# EAGLE design 1 (EAGLE 6.5.0)
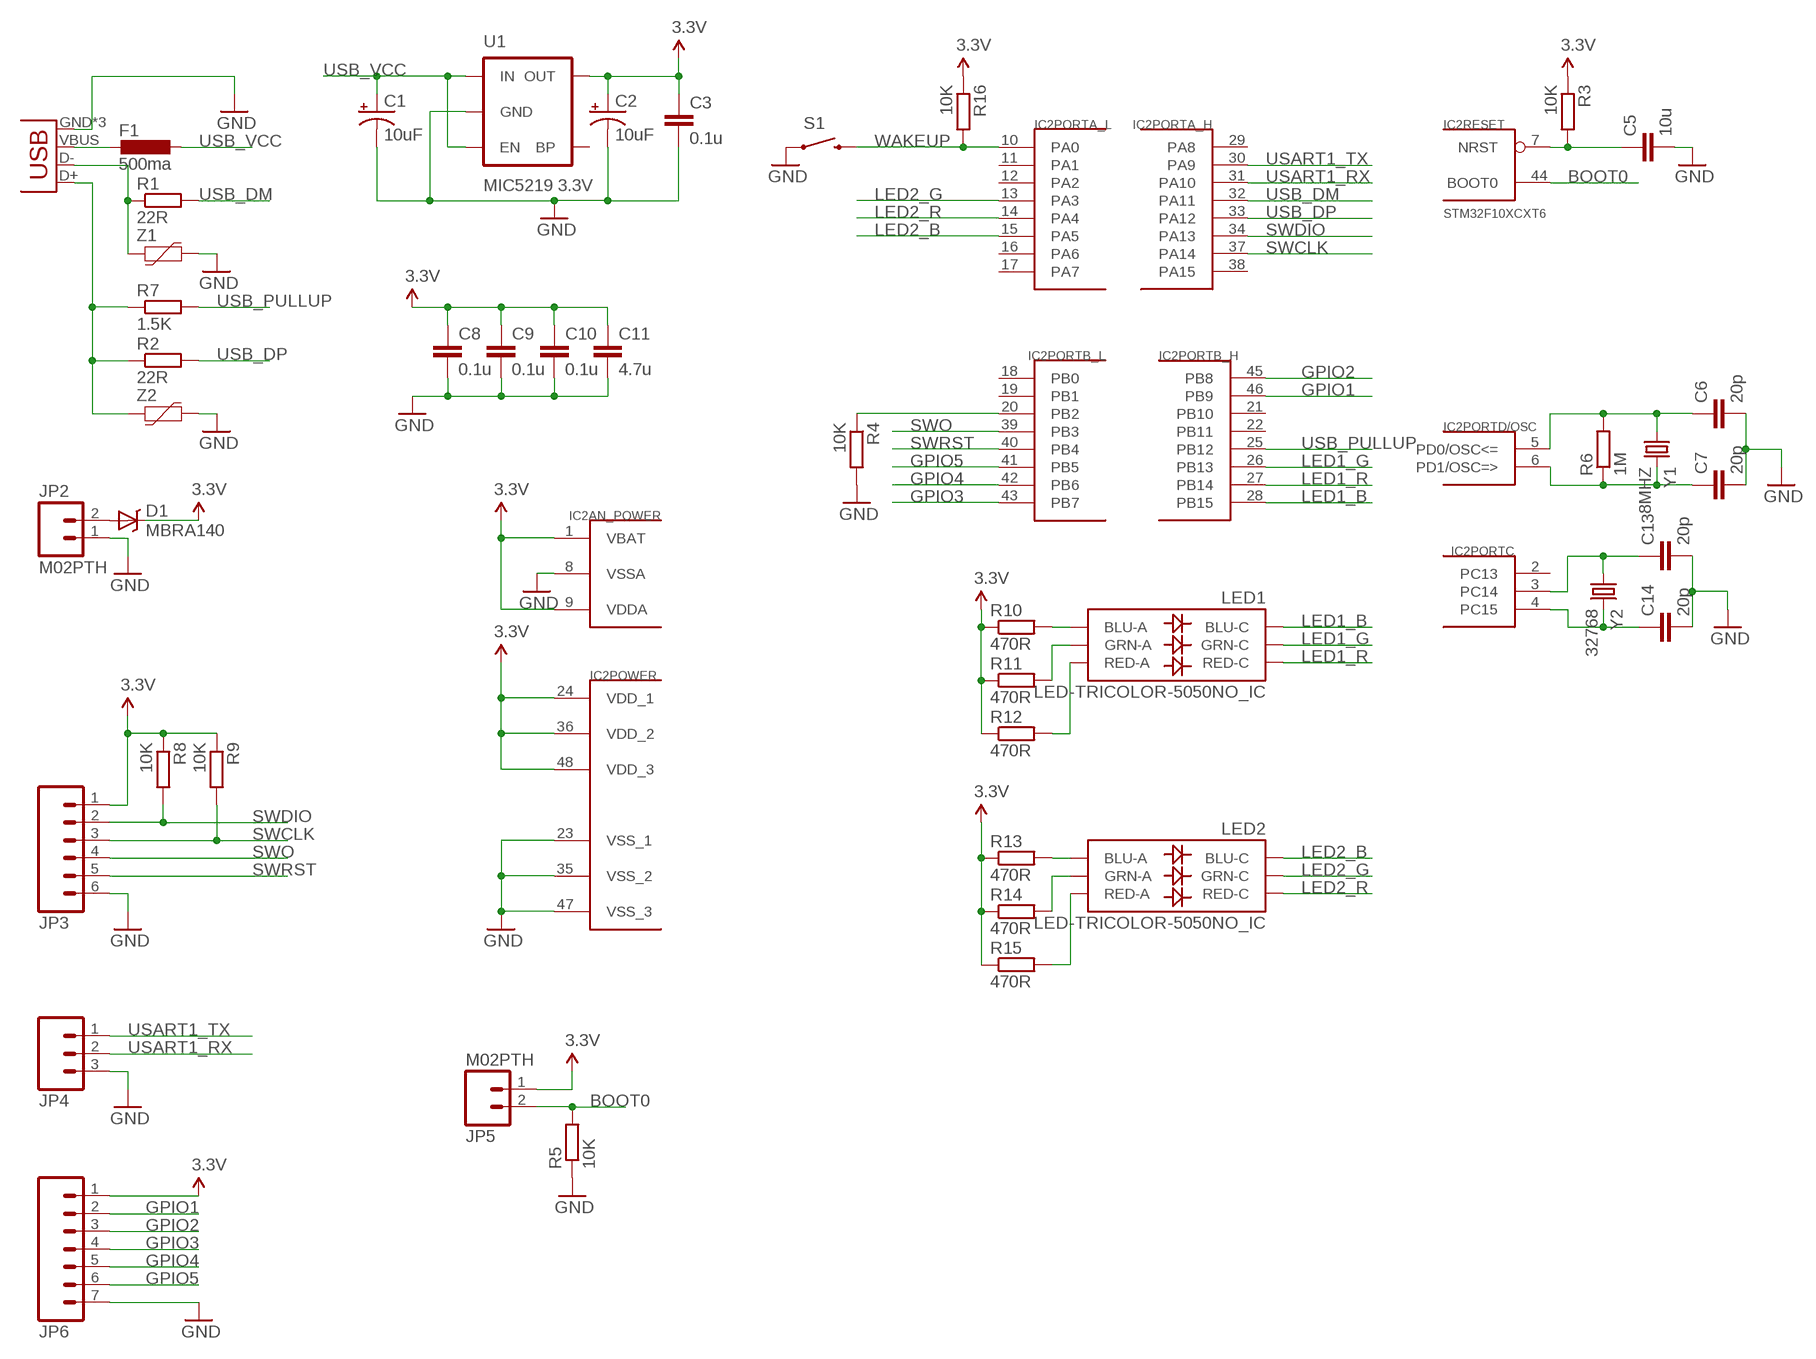
[diagram p0: schematic, sheet 1]

## Parts
C1  10uF  10UF-TANT  [EIA3216]
C2  10uF  10UF-TANT  [EIA3216]
C3  0.1u  C-EUC0603K  [C0603K]
C5  10u  C-EUC0603K  [C0603K]
C6  20p  C-EUC0603K  [C0603K]
C7  20p  C-EUC0603K  [C0603K]
C8  0.1u  C-EUC0603K  [C0603K]
C9  0.1u  C-EUC0603K  [C0603K]
C10  0.1u  C-EUC0603K  [C0603K]
C11  4.7u  C-EUC0603K  [C0603K]
C13  20p  C-EUC0603K  [C0603K]
C14  20p  C-EUC0603K  [C0603K]
D1  MBRA140  [SMA-DIODE]
F1  500ma  L-EUL2012C  [L2012C]
IC2  STM32F10XCXT6  [TQFP48]
JP1  USB-MICROB  [USB-MICROB]
JP2  M02PTH  [1X02]
JP3  M06SIP  [1X06]
JP4  M03PTH  [1X03]
JP5  M02PTH  [1X02]
JP6  M07  [1X07]
LED1  LED-TRICOLOR-5050NO_IC  [LED-TRICOLOR-5050]
LED2  LED-TRICOLOR-5050NO_IC  [LED-TRICOLOR-5050]
R1  22R  R-EU_R0603  [R0603]
R2  22R  R-EU_R0603  [R0603]
R3  10K  R-EU_R0603  [R0603]
R4  10K  R-EU_R0603  [R0603]
R5  10K  R-EU_R0603  [R0603]
R6  1M  R-EU_R0603  [R0603]
R7  1.5K  R-EU_R0603  [R0603]
R8  10K  R-EU_R0603  [R0603]
R9  10K  R-EU_R0603  [R0603]
R10  470R  R-EU_R0603  [R0603]
R11  470R  R-EU_R0603  [R0603]
R12  470R  R-EU_R0603  [R0603]
R13  470R  R-EU_R0603  [R0603]
R14  470R  R-EU_R0603  [R0603]
R15  470R  R-EU_R0603  [R0603]
R16  10K  R-EU_R0603  [R0603]
S1  SWITCH-MOMENTARY-2SMD-4  [TACTILE_SWITCH_TALL]
U1  MIC5219 3.3V  V_REG_MIC52193.3V  [SOT23-5]
Y1  8MHZ  CRYSTAL5X3  [CRYSTAL-SMD-5X3]
Y2  32768  CRYSTALEPSONMC146  [CRYSTAL-32KHZ-SMD_EPSON_MC146]
Z1  VARISTOR-0603  [0603-RES]
Z2  VARISTOR-0603  [0603-RES]

## Nets
3.3V: C2.A(+) C3.1 C8.1 C9.1 C10.1 C11.1 D1.C IC2.1(AN_POWER:VBAT) IC2.9(AN_POWER:VDDA) IC2.24(POWER:VDD_1) IC2.36(POWER:VDD_2) IC2.48(POWER:VDD_3) JP3.1 JP5.1 JP6.1 R3.1 R8.1 R9.1 R10.1 R11.1 R12.1 R13.1 R14.1 R15.1 R16.1 U1.5(OUT)
BOOT0: IC2.44(RESET:BOOT0) JP5.2 R5.2
GND: C1.C(-) C2.C(-) C3.2 C5.2 C6.2 C7.2 C8.2 C9.2 C10.2 C11.2 C13.2 C14.2 IC2.8(AN_POWER:VSSA) IC2.23(POWER:VSS_1) IC2.35(POWER:VSS_2) IC2.47(POWER:VSS_3) JP1.GND JP1.MT1(GND) JP1.MT2(GND) JP2.1 JP3.6 JP4.3 JP6.7 R4.2 R5.1 S1.A2 U1.2(GND) Z1.2 Z2.2
GPIO1: IC2.46(PORTB_H:PB9) JP6.2
GPIO2: IC2.45(PORTB_H:PB8) JP6.3
GPIO3: IC2.43(PORTB_L:PB7) JP6.4
GPIO4: IC2.42(PORTB_L:PB6) JP6.5
GPIO5: IC2.41(PORTB_L:PB5) JP6.6
LED1_B: IC2.28(PORTB_H:PB15) LED1.4(BLU-C)
LED1_G: IC2.26(PORTB_H:PB13) LED1.6(GRN-C)
LED1_R: IC2.27(PORTB_H:PB14) LED1.5(RED-C)
LED2_B: IC2.15(PORTA_L:PA5) LED2.4(BLU-C)
LED2_G: IC2.13(PORTA_L:PA3) LED2.6(GRN-C)
LED2_R: IC2.14(PORTA_L:PA4) LED2.5(RED-C)
N$1: D1.A JP2.2
N$2: IC2.20(PORTB_L:PB2) R4.1
N$3: JP1.D- R1.1 Z1.1
N$4: JP1.D+ R2.1 R7.1 Z2.1
N$6: C6.1 IC2.5(PORTD/OSC:PD0/OSC<=) R6.2 Y1.1
N$7: C7.1 IC2.6(PORTD/OSC:PD1/OSC=>) R6.1 Y1.3
N$8: LED1.3(BLU-A) R10.2
N$9: F1.2 JP1.VBUS
N$10: LED1.1(GRN-A) R11.2
N$11: LED1.2(RED-A) R12.2
N$12: LED2.3(BLU-A) R13.2
N$13: LED2.1(GRN-A) R14.2
N$14: LED2.2(RED-A) R15.2
N$18: C13.1 IC2.3(PORTC:PC14) Y2.P$2
N$19: C14.1 IC2.4(PORTC:PC15) Y2.P$1
RESET: C5.1 IC2.7(RESET:NRST) R3.2
SWCLK: IC2.37(PORTA_H:PA14) JP3.3 R9.2
SWDIO: IC2.34(PORTA_H:PA13) JP3.2 R8.2
SWO: IC2.39(PORTB_L:PB3) JP3.4
SWRST: IC2.40(PORTB_L:PB4) JP3.5
USART1_RX: IC2.31(PORTA_H:PA10) JP4.2
USART1_TX: IC2.30(PORTA_H:PA9) JP4.1
USB_DM: IC2.32(PORTA_H:PA11) R1.2
USB_DP: IC2.33(PORTA_H:PA12) R2.2
USB_PULLUP: IC2.25(PORTB_H:PB12) R7.2
USB_VCC: C1.A(+) F1.1 U1.1(IN) U1.3(EN)
WAKEUP: IC2.10(PORTA_L:PA0) R16.2 S1.B2
Unconnected: IC2.2(PORTC:PC13) IC2.11(PORTA_L:PA1) IC2.12(PORTA_L:PA2) IC2.16(PORTA_L:PA6) IC2.17(PORTA_L:PA7) IC2.18(PORTB_L:PB0) IC2.19(PORTB_L:PB1) IC2.21(PORTB_H:PB10) IC2.22(PORTB_H:PB11) IC2.29(PORTA_H:PA8) IC2.38(PORTA_H:PA15) U1.4(BP)

## Library data of the parts
C1 C2 = SparkFun-Capacitors:10UF-TANT: 10uF Tantalum SMT CAP-00811- 16V 10% (EIA-3216); PROD_ID: CAP-00811
C3 C5-C11 C13 C14 = rcl:C-EU: CAPACITOR, European symbol
D1 = SparkFun-DiscreteSemi:MBRA140: 40V, 1A Schottky rectifier SMA/DO-214AC package DIO-08053; PROD_ID: DIO-08053
F1 = rcl:L-EU: INDUCTOR, European symbol
IC2 = stm32:STM32F10XCXT6: ST STM32F101/103 48pin LQFP
JP1 = SparkFun-Connectors:USB: USB Connectors USB-B-PTH is fully proven SKU : PRT-00139/CONN-08278 USB-miniB is fully proven SKU : PRT-00587 USB-A-PCB is untested. USB-A-H is throughly reviewed, but untested. Spark Fun Electronics SKU : PRT-00437 USB-B-SMT is throughly reviewed, but untested. Needs silkscreen touching up. USB-A-S has not been used/tested USB-MB-H has not been used/tested USB-MICROB has been used. CONN-09505; PROD_ID: CONN-09505
JP2 JP5 = SparkFun-Connectors:M02: Standard 2-pin 0.1" header. Use with - straight break away headers ( PRT-00116) - right angle break away headers (PRT-00553) - swiss pins (PRT-00743) - machine pins (PRT-00117) - female headers (PRT-00115) Molex polarized connector foot print use with: PRT-08233 with associated crimp pins and housings. 2.54_SCREWTERM for use with PRT-10571. 3.5mm Screw Terminal footprints for PRT-08084 5mm Screw Terminal footprints for use with PRT-08433
JP3 = SparkFun-Connectors:M06: Header 6 Standard 6-pin 0.1" header. Use with straight break away headers (SKU : PRT-00116), right angle break away headers (PRT-00553), swiss pins (PRT-00743), machine pins (PRT-00117), and female headers (PRT-00115). Molex polarized connector foot print use with SKU : PRT-08094 with associated crimp pins and housings. NOTES ON THE VARIANTS LOCK and LOCK_LONGPADS... This footprint was designed to help hold the alignment of a through-hole component (i.e. 6-pin header) while soldering it into place. You may notice that each hole has been shifted either up or down by 0.005 of an inch from it's more standard position (which is a perfectly straight line). This slight alteration caused the pins (the squares in the middle) to touch the edges of the holes. Because they are alternating, it causes a "brace" to hold the component in place. 0.005 has proven to be the perfect amount of "off-center" position when using our standard breakaway headers. Although looks a little odd when you look at the bare footprint, once you have a header in there, the alteration is very hard to notice. Also,if you push a header all the way into place, it is covered up entirely on the bottom side. This idea of altering the position of holes to aid alignment will be further integrated into the Sparkfun Library for other footprints. It can help hold any component with 3 or more connection pins.
JP4 = SparkFun-Connectors:M03: Header 3 Standard 3-pin 0.1" header. Use with straight break away headers (SKU : PRT-00116), right angle break away headers (PRT-00553), swiss pins (PRT-00743), machine pins (PRT-00117), and female headers (PRT-00115). Molex polarized connector foot print use with SKU : PRT-08232 with associated crimp pins and housings.
JP6 = SparkFun-Connectors:M07: Header 7 Standard 7-pin 0.1" header. Use with straight break away headers (SKU : PRT-00116), right angle break away headers (PRT-00553), swiss pins (PRT-00743), machine pins (PRT-00117), and female headers (PRT-00115). NOTES ON THE VARIANTS LOCK and LOCK_LONGPADS... This footprint was designed to help hold the alignment of a through-hole component (i.e. 7-pin header) while soldering it into place. You may notice that each hole has been shifted either up or down by 0.005 of an inch from it's more standard position (which is usually a perfectly straight line). This slight alteration caused the pins (the squares in the middle) to touch the edges of the holes. Because they are alternating, it causes a "brace" to hold the header in place. 0.005 has proven to be the perfect amount of "off-center" position when using our standard breakaway headers. Although looks a little odd when you look at the bare footprint, once you have a header in there, the alteration is very hard to notice. Also, if you push a header all the way into place, it is covered up entirely on the bottom side. This idea of altering the position of holes to aid alignment will be further integrated into the Sparkfun Library for other footprints. It can help hold any component with 3 or more connection pins.
LED1 LED2 = SparkFun-LED:LED-TRICOLOR-5050
R1-R16 = rcl:R-EU_: RESISTOR, European symbol
S1 = SparkFun-Electromechanical:SWITCH-MOMENTARY-2: Various NO switches- pushbuttons, reed, etc
U1 = SparkFun-PowerIC:V_REG_MIC5219: V_REG MIC5219 Standard 3.3V and 5V 500mA LDO voltage regulator in SOT-23 layout. Micrel part MIC5219. BP (by-pass) pin is used to lower output noise with 470pF cap, may be left open.; PROD_ID: VREG-09872
Y1 Y2 = SparkFun-FreqCtrl:CRYSTAL: Various standard crystals. Proven footprints. Spark Fun Electronics SKU : COM-00534
Z1 Z2 = SparkFun-DiscreteSemi:VARISTOR: Varistor Varistor (Variable resistor) is a nonlinear resistive element of the voltage dependence that resistance changes with applied voltage. Varistor is equivalent with Zener diode of two series connection.

## Board
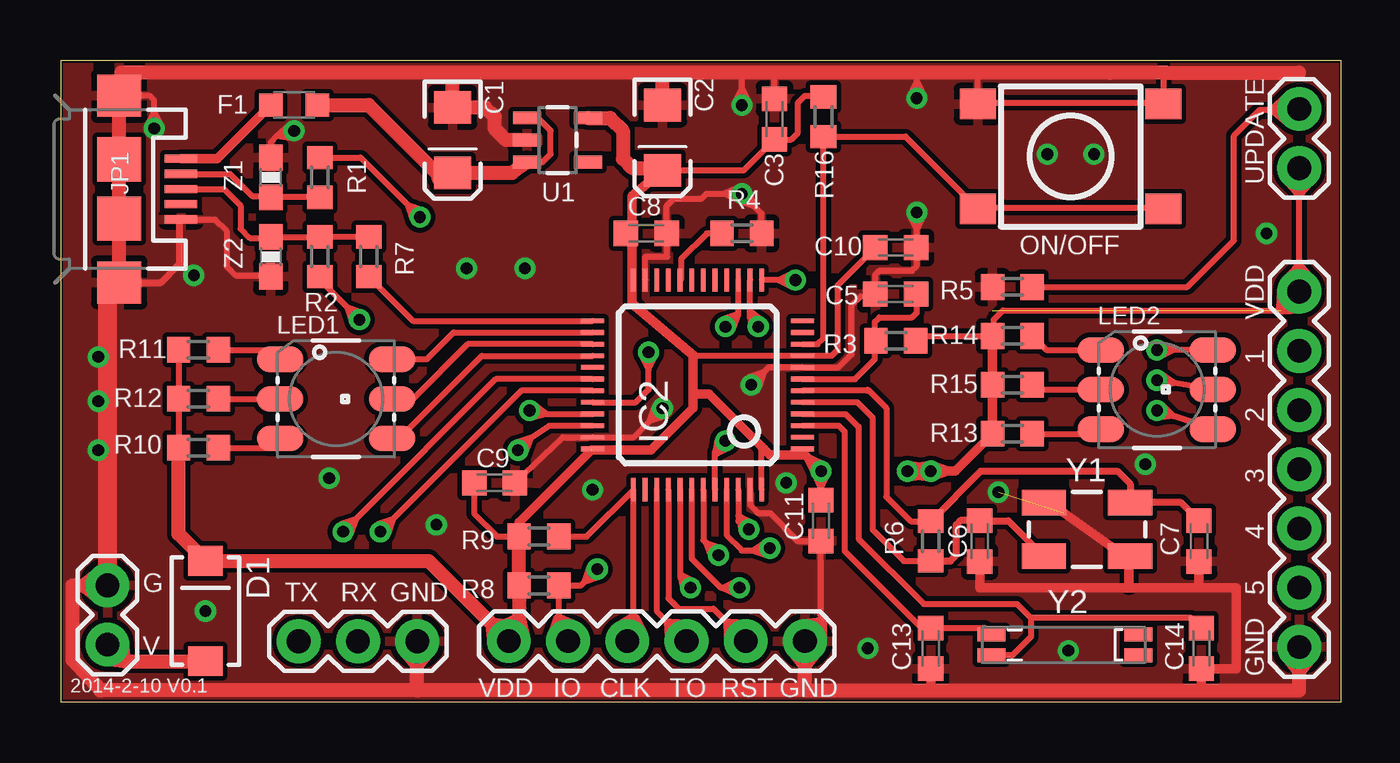
[diagram p1: board, top side]
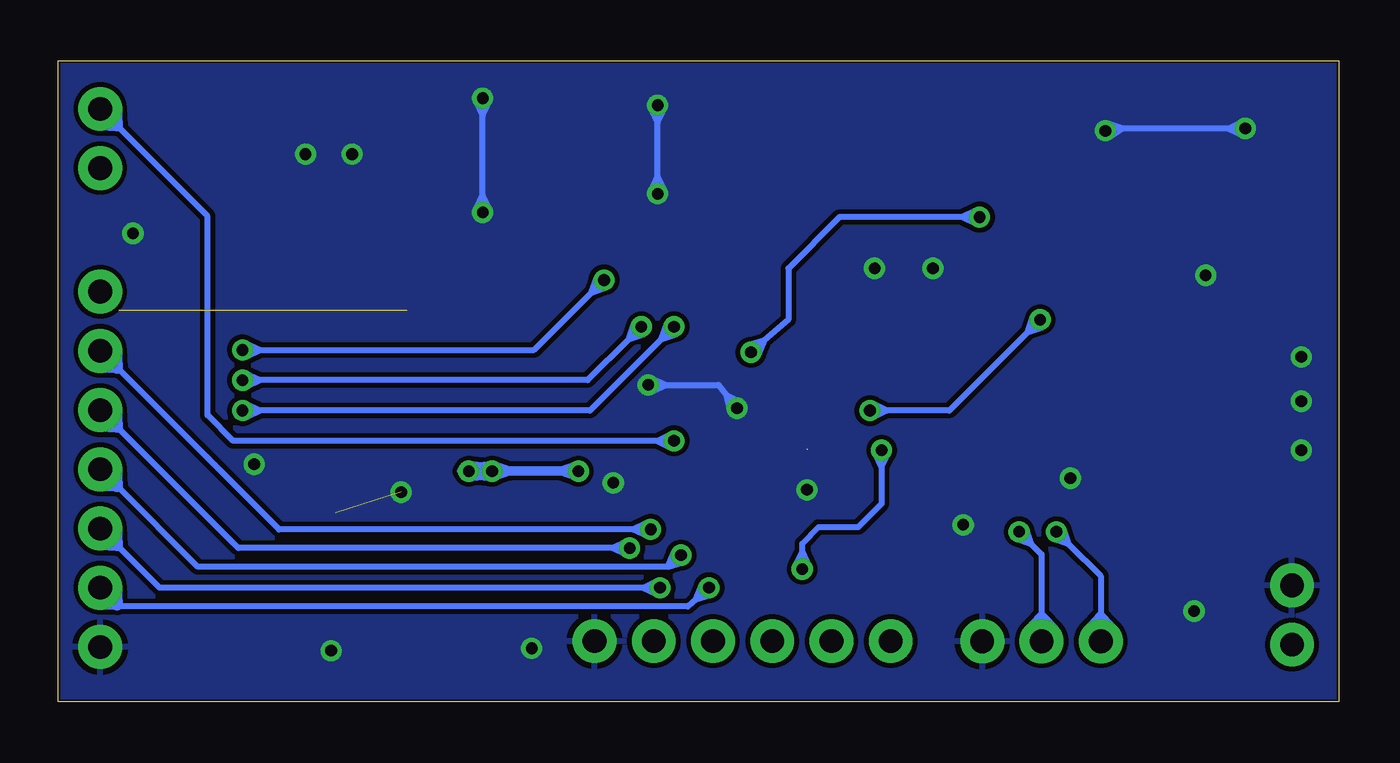
[diagram p2: board, bottom side, seen from below]

Size 54.9 x 27.5 mm. Coordinates in mm from the lower left corner, seen from the top.
Outline: 0,0 54.9,0 54.9,27.5 0,27.5 0,0
Copper layers (1*16): Top 0.035mm / dielectric 1.5mm / Bottom 0.035mm
Design rules "default *": minimum track width 10mil, minimum drill 24mil, track to track 8mil, track to pad 8mil, pad to pad 8mil, via to via 8mil, smd to smd 8mil, copper to edge 0.1mm, drill to drill 8mil, minimum pad ring 10mil, minimum via ring 8mil, stop-mask expansion 4mil, vias tented up to drill 0mil, thermal gap 10mil

### Footprints (pad centres in the part's own frame; a part is rotated, then mirrored left to right if it is on the bottom)
EIA3216 = smd 1.4 x 1.6: A 1.4,0; C -1.4,0
C0603K = smd 1.05 x 1.08: 1 -0.875,0; 2 0.875,0
SMA-DIODE = smd 1.27 x 1.47: A -2.15,0; C 2.15,0
L2012C = smd 1 x 1: 1 -1,0; 2 1,0
TQFP48 = smd 0.2 x 1: 1 -2.75,-4.5; 2 -2.25,-4.5; 3 -1.75,-4.5; 4 -1.25,-4.5; 5 -0.75,-4.5; 6 -0.25,-4.5; 7 0.25,-4.5; 8 0.75,-4.5; 9 1.25,-4.5; 10 1.75,-4.5; 11 2.25,-4.5; 12 2.75,-4.5; 25 2.75,4.5; 26 2.25,4.5; 27 1.75,4.5; 28 1.25,4.5; 29 0.75,4.5; 30 0.25,4.5; 31 -0.25,4.5; 32 -0.75,4.5; 33 -1.25,4.5; 34 -1.75,4.5; 35 -2.25,4.5; 36 -2.75,4.5 | smd 1 x 0.2: 13 4.5,-2.75; 14 4.5,-2.25; 15 4.5,-1.75; 16 4.5,-1.25; 17 4.5,-0.75; 18 4.5,-0.25; 19 4.5,0.25; 20 4.5,0.75; 21 4.5,1.25; 22 4.5,1.75; 23 4.5,2.25; 24 4.5,2.75; 37 -4.5,2.75; 38 -4.5,2.25; 39 -4.5,1.75; 40 -4.5,1.25; 41 -4.5,0.75; 42 -4.5,0.25; 43 -4.5,-0.25; 44 -4.5,-0.75; 45 -4.5,-1.25; 46 -4.5,-1.75; 47 -4.5,-2.25; 48 -4.5,-2.75
USB-MICROB = smd 0.35 x 1.4: D+ 0,2.65; D- -0.65,2.65; GND 1.3,2.65; ID 0.65,2.65; VBUS -1.3,2.65 | smd 1.8 x 1.9: MT1 -4,0; MT2 4,0 | smd 1.9 x 1.9: P$1 -1.27,0; P$2 1.27,0
1X02 = drill 1.016 pad 1.88: 1 0,0; 2 2.54,0
1X06 = drill 1.016 pad 1.88: 1 0,0; 2 2.54,0; 3 5.08,0; 4 7.62,0; 5 10.16,0; 6 12.7,0
1X03 = drill 1.016 pad 1.88: 1 0,0; 2 2.54,0; 3 5.08,0
1X07 = drill 1.016 pad 1.88: 1 0,0; 2 2.54,0; 3 5.08,0; 4 7.62,0; 5 10.16,0; 6 12.7,0; 7 15.24,0
LED-TRICOLOR-5050 = smd 2 x 1.1: 1 -2.4,1.7; 2 -2.4,0; 3 -2.4,-1.7; 4 2.4,-1.7; 5 2.4,0; 6 2.4,1.7
R0603 = smd 1 x 1.1: 1 -0.85,0; 2 0.85,0
TACTILE_SWITCH_TALL = smd 1.55 x 1.3: A1 -3.975,-2.25; A2 3.975,-2.25; B1 -3.975,2.25; B2 3.975,2.25
SOT23-5 = smd 0.55 x 1.2: 1 -0.95,-1.3; 2 0,-1.3; 3 0.95,-1.3; 4 0.95,1.3; 5 -0.95,1.3
CRYSTAL-SMD-5X3 = smd 1.9 x 1.1: 1 -1.85,-1.15; 2 1.85,-1.15; 3 1.85,1.15; 4 -1.85,1.15
CRYSTAL-32KHZ-SMD_EPSON_MC146 = smd 1.2 x 0.6: NC1 6.9,1.2; NC2 6.9,0.3; P$1 0.6,0.3; P$2 0.6,1.2
0603-RES = smd 1.1 x 1: 1 -0.85,0; 2 0.85,0

### Placement (x,y rotation side)
C1  16.8,24.1 270 top
C2  25.8,24.2 270 top
C3  30.6,25 90 top
C5  35.8,17.5 180 top
C6  39.4,6.9 270 top
C7  48.8,6.9 270 top
C8  25.1,20.1 0 top
C9  18.6,9.4 0 top
C10  35.8,19.49 0 top
C11  32.59,7.78 270 top
C13  37.3,2.3 270 top
C14  48.9,2.3 270 top
D1  6.2,3.9 90 top
F1  10,25.6 180 top
IC2  27.3,13.6 90 top
JP1  2.5,22 270 top
JP2  2,5 270 top
JP3  19.21,2.61 0 top
JP4  10.2,2.6 0 top
JP5  53.1,22.9 90 top
JP6  53.1,17.6 270 top
LED1  11.8,13 0 top
LED2  47,13.4 0 top
R1  11.1,22.5 90 top
R2  11.1,19.1 270 top
R3  35.8,15.5 180 top
R4  29.2,20.1 0 top
R5  40.8,17.8 0 top
R6  37.3,6.9 270 top
R7  13.2,19.1 270 top
R8  20.5,5 0 top
R9  20.5,7.1 0 top
R10  5.9,10.9 0 top
R11  5.9,15.1 0 top
R12  5.9,13 0 top
R13  40.8,11.5 0 top
R14  40.8,15.7 0 top
R15  40.8,13.6 0 top
R16  32.7,25.1 270 top
S1  43.3,23.4 180 top
U1  21.3,24.1 270 top
Y1  44,7.4 0 top
Y2  39.3,1.7 0 top
Z1  9,22.5 90 top
Z2  9,19.1 270 top

### Tracks (layer width: path | path; a pad name or v marks a point on that pad's centre or on a via)
3.3V  (via drill 0.5, 0.5 pad 0.25)  (2 unrouted)
  Top 0.254: R10.1 R12.1 R11.1 | 19.65,2.45 JP3.1 | 27.1,14.8 27.15,14.85 IC2.9 33.05,14.85 33.3,15.1 33.3,17.86 C10.1 | C2.A 29.27,22.8 C3.1 31.32,24.12 31.6,24.4 31.6,25.7 31.9,26 32.65,26 R16.1 32.42,25.95 | IC2.24 24.55,17.85 24.5,17.6 | IC2.48 30.05,10.95 30.15,10.85 | 27.3,13.2 27.1,13.4 | C8.1 24.5,20.38 24.5,20.8 | C11.1 32.59,9.15 | 32.59,9.15 32.59,9.59 v32.6,9.9 | C9.1 17.73,8.07 18.7,7.1 R9.1 | R3.1 36.85,15.7 R14.1 40,15.7 40,16.4 40.4,16.8 52.3,16.8 52.38,16.88 JP6.1 53.1,18.62 53.1,21.88 JP5.1 | 31.9,10.6 31.9,10.75 IC2.1 | 32.59,9.15 32.89,9.75 v32.6,9.9 | 32.59,9.15 32.3,9.76 v32.6,9.9
  Top 0.406: C2.A 24.5,21.7 24.5,20.8 24.5,17.6 24.5,17.1 27.15,14.85 | 27.1,14.8 27.1,13.4 27.1,12.6 25.3,10.8 22.75,10.8 19.65,7.7 R9.1 | R14.1 R15.1 R13.1 38.35,9.9 38.05,9.9 | 30.05,10.95 27.8,13.2 27.3,13.2 | v36.3,9.9 36.55,9.9 | 36.55,9.9 37.05,9.9 | 37.05,9.9 v37.3,9.9 | v37.3,9.9 38.05,9.9 | v32.6,9.9 32.07,10.43 | 32.07,10.43 31.9,10.6 30.4,10.6 30.15,10.85 | 36.55,9.9 37.03,9.73 | 37.03,9.73 37.22,9.66 | 32.07,10.43 32.37,9.79 v32.6,9.9 | 32.07,10.43 32.71,10.13 v32.6,9.9 | 36.57,10.07 36.38,10.14 | v36.3,9.9 36.38,10.14 | 37.05,9.9 36.38,9.66 | v36.3,9.9 36.38,9.66 | 37.05,9.9 36.57,10.07 | 36.57,10.07 36.38,10.14 | 37.05,9.9 36.38,9.66 | 37.05,9.9 36.38,10.14 | v36.3,9.9 36.38,10.14 | 37.05,9.9 36.38,9.66 | v36.3,9.9 36.38,9.66 | 37.03,9.73 36.44,10.11 v36.3,9.9 | 37.03,9.73 36.33,9.65 v36.3,9.9 | v36.3,9.9 36.33,10.15 37.03,10.07 36.44,9.69 v36.3,9.9 | 36.55,9.9 37.22,9.66 | v37.3,9.9 37.22,9.66 | 36.55,9.9 37.22,10.14 | v37.3,9.9 37.22,10.14 | 38.05,9.9 37.38,10.14 | v37.3,9.9 37.38,10.14 | 38.05,9.9 37.38,9.66 | v37.3,9.9 37.38,9.66 | 36.57,10.07 37.16,9.69 v37.3,9.9 | 36.57,10.07 37.27,10.15 v37.3,9.9 | v37.3,9.9 37.27,9.65 36.57,9.73 37.16,10.11 v37.3,9.9 | 36.55,9.9 37.22,9.66 | 36.55,9.9 37.22,10.14 | 36.55,9.9 37.22,9.66 | v37.3,9.9 37.22,9.66 | 36.55,9.9 37.22,10.14 | v37.3,9.9 37.22,10.14 | 38.05,9.9 37.38,10.14 | 38.05,9.9 37.38,9.66 | 38.05,9.9 37.38,10.14 | v37.3,9.9 37.38,10.14 | 38.05,9.9 37.38,9.66 | v37.3,9.9 37.38,9.66
  Top 0.508: JP6.1 53.13,16.91 52.38,16.88 52.41,17.63 JP6.1 | JP6.1 52.59,18.06 53.1,18.62 53.61,18.06 JP6.1 | 53.1,21.88 53.61,22.44 JP5.1 52.59,22.44 53.1,21.88
  Top 0.61: 19.65,3.53 R8.1 R9.1 | 19.65,3.53 19.65,2.45 | R10.1 5.05,7.2 D1.C 15.77,6.05 18.49,3.33 | 18.49,3.33 JP3.1 | U1.5 23.55,25.05 24.1,24.5 24.1,23.3 24.5,22.9 25.7,22.9 C2.A | 19.65,3.53 18.93,3.18 JP3.1 | 19.65,3.53 19.83,2.75 JP3.1 | 18.49,3.33 18.58,2.54 JP3.1 | 18.49,3.33 19.28,3.24 JP3.1
  Bottom 0.406: v32.6,9.9 33.35,9.9 | 33.35,9.9 35.55,9.9 | 35.55,9.9 v36.3,9.9 | v36.3,9.9 36.55,9.9 | 36.55,9.9 37.05,9.9 | 37.05,9.9 v37.3,9.9 | v37.3,9.9 37.6,9.9 | 36.55,9.9 37.03,9.73 | 37.03,9.73 37.22,9.66 | 33.35,9.9 32.68,10.14 | v32.6,9.9 32.68,10.14 | 33.35,9.9 32.68,9.66 | v32.6,9.9 32.68,9.66 | 33.35,9.9 32.68,10.14 | 33.35,9.9 32.68,9.66 | 33.35,9.9 32.68,10.14 | v32.6,9.9 32.68,10.14 | 33.35,9.9 32.68,9.66 | v32.6,9.9 32.68,9.66 | 35.55,9.9 36.22,9.66 | v36.3,9.9 36.22,9.66 | 35.55,9.9 36.22,10.14 | v36.3,9.9 36.22,10.14 | 36.57,10.07 36.38,10.14 | v36.3,9.9 36.38,10.14 | 37.05,9.9 36.38,9.66 | v36.3,9.9 36.38,9.66 | 35.55,9.9 36.22,9.66 | 35.55,9.9 36.22,10.14 | 35.55,9.9 36.22,9.66 | v36.3,9.9 36.22,9.66 | 35.55,9.9 36.22,10.14 | v36.3,9.9 36.22,10.14 | 37.05,9.9 36.57,10.07 | 36.57,10.07 36.38,10.14 | 37.05,9.9 36.38,9.66 | 37.05,9.9 36.38,10.14 | v36.3,9.9 36.38,10.14 | 37.05,9.9 36.38,9.66 | v36.3,9.9 36.38,9.66 | 37.03,9.73 36.44,10.11 v36.3,9.9 | 37.03,9.73 36.33,9.65 v36.3,9.9 | v36.3,9.9 36.33,10.15 37.03,10.07 36.44,9.69 v36.3,9.9 | 36.55,9.9 37.22,9.66 | v37.3,9.9 37.22,9.66 | 36.55,9.9 37.22,10.14 | v37.3,9.9 37.22,10.14 | 36.57,10.07 37.16,9.69 v37.3,9.9 | 36.57,10.07 37.27,10.15 v37.3,9.9 | v37.3,9.9 37.27,9.65 36.57,9.73 37.16,10.11 v37.3,9.9 | 36.55,9.9 37.22,9.66 | 36.55,9.9 37.22,10.14 | 36.55,9.9 37.22,9.66 | v37.3,9.9 37.22,9.66 | 36.55,9.9 37.22,10.14 | v37.3,9.9 37.22,10.14
BOOT0  (via drill 0.5)
  Top 0.254: IC2.44 28.05,10.6 | 28.05,10.6 28.05,10.75 v28.5,11.2 | R5.2 48.3,17.8 50.3,19.8 50.3,24.3 51.4,25.4 52.09,25.4 53.06,25.4 JP5.2 | 28.05,10.6 28.65,10.91 v28.5,11.2 | 28.05,10.6 28.18,11.26 v28.5,11.2
  Top 0.508: 52.09,25.4 52.66,24.92 JP5.2 52.62,25.93 52.09,25.4
  Bottom 0.254: v28.5,11.2 29.25,11.2 | 29.25,11.2 47.4,11.2 48.5,12.3 48.5,20.84 52.38,24.72 JP5.2 | 29.25,11.2 28.64,11.49 | v28.5,11.2 28.64,11.49 | 29.25,11.2 28.64,10.91 | v28.5,11.2 28.64,10.91 | 29.25,11.2 28.64,11.49 | 28.64,11.49 | v28.5,11.2 28.64,11.49 | 29.25,11.2 28.64,10.91 | v28.5,11.2 28.64,10.91 | 29.25,11.2 28.64,11.49 | v28.5,11.2 28.64,11.49 | 29.25,11.2 28.64,10.91 | v28.5,11.2 28.64,10.91
  Bottom 0.508: 52.38,24.72 53.13,24.75 JP5.2 52.41,25.47 52.38,24.72
GND  (via drill 0.5, 0.5 pad 0.25)  (1 unrouted)
  Top 0.254: Z1.2 9,24 9.28,24.28 | 9.28,24.28 9.5,24.5 v10,24.5 | JP1.GND 6.6,20.7 7.1,20.2 7.1,18.7 7.5,18.3 8.95,18.3 Z2.2 | C3.2 30.6,27 | 48.9,1.3 C14.2 49.42,1.43 48.9,0.9 | v29.2,25.6 29.2,26.35 | 29.2,26.35 29.2,27 | 30.13,14.13 30.35,14.35 IC2.8 33.35,14.35 33.9,14.9 33.9,17 34.3,17.4 C5.2 34.92,18.32 35.1,18.5 36.5,18.5 36.7,18.7 36.7,19.46 C10.2 36.67,19.15 36.7,19.15 36.7,20.25 | 30.13,14.13 v29.6,13.6 | C6.2 39.4,5.6 | 48.8,5.6 C7.2 | 25.27,12.07 24.55,11.35 IC2.35 21.52,11.35 C9.2 | 25.27,12.07 v25.8,12.6 | R4.2 30.05,20.95 29.73,21.27 | 29.73,21.27 v29.2,21.8 | 28.45,21.8 27.68,21.8 27.48,21.6 26.3,21.6 25.98,21.27 C8.2 26,20.1 26,19.1 25.05,19.1 IC2.23 | 28.45,21.8 v29.2,21.8 | 47.5,26.9 47.4,27 | S1.A2 39.33,26.98 39.3,27 | 36.7,20.25 v36.7,21 | v36.7,25.9 36.7,26.65 | 36.7,26.65 36.7,27 | JP3.6 32.59,3.29 32.59,3.37 C11.2 31.59,6.91 30.4,8.1 29.9,8.1 29.55,8.45 IC2.47 | v4,24.6 4,25.35 | 4,25.35 4,25.8 3.8,26 JP1.MT1 | 9.28,24.28 9.95,24.18 v10,24.5 | 9.28,24.28 9.78,24.74 v10,24.5 | 4,25.35 | 4,25.35 3.71,24.74 | v4,24.6 3.71,24.74 | 4,25.35 | 4,25.35 4.29,24.74 | v4,24.6 4.29,24.74 | 4,25.35 3.71,24.74 | 3.71,24.74 | v4,24.6 3.71,24.74 | 4,25.35 4.29,24.74 | v4,24.6 4.29,24.74 | 4,25.35 3.71,24.74 | v4,24.6 3.71,24.74 | 4,25.35 4.29,24.74 | v4,24.6 4.29,24.74 | 28.45,21.8 | 28.45,21.8 29.06,21.51 | v29.2,21.8 29.06,21.51 | 28.45,21.8 | 28.45,21.8 29.06,22.09 | v29.2,21.8 29.06,22.09 | 29.73,21.27 29.51,21.91 v29.2,21.8 | 29.73,21.27 29.09,21.49 v29.2,21.8 | 28.45,21.8 29.06,21.51 | 29.06,21.51 | v29.2,21.8 29.06,21.51 | 28.45,21.8 29.06,22.09 | v29.2,21.8 29.06,22.09 | 28.45,21.8 29.06,21.51 | v29.2,21.8 29.06,21.51 | 28.45,21.8 29.06,22.09
  Top 0.254: v29.2,21.8 29.06,22.09 | 29.2,26.35 | 29.2,26.35 28.91,25.74 | v29.2,25.6 28.91,25.74 | 29.2,26.35 | 29.2,26.35 29.49,25.74 | v29.2,25.6 29.49,25.74 | 29.2,26.35 28.91,25.74 | 28.91,25.74 | v29.2,25.6 28.91,25.74 | 29.2,26.35 29.49,25.74 | v29.2,25.6 29.49,25.74 | 29.2,26.35 28.91,25.74 | v29.2,25.6 28.91,25.74 | 29.2,26.35 29.49,25.74 | v29.2,25.6 29.49,25.74 | 25.27,12.07 25.91,12.29 v25.8,12.6 | 25.27,12.07 25.49,12.71 v25.8,12.6 | 30.13,14.13 29.49,13.91 v29.6,13.6 | 30.13,14.13 29.91,13.49 v29.6,13.6 | 36.7,20.25 36.99,20.86 | v36.7,21 36.99,20.86 | 36.7,20.25 36.41,20.86 | v36.7,21 36.41,20.86 | 36.7,20.25 36.99,20.86 | 36.99,20.86 | v36.7,21 36.99,20.86 | 36.7,20.25 36.41,20.86 | v36.7,21 36.41,20.86 | 36.7,20.25 36.99,20.86 | v36.7,21 36.99,20.86 | 36.7,20.25 36.41,20.86 | v36.7,21 36.41,20.86 | 36.7,26.65 | 36.7,26.65 36.41,26.04 | v36.7,25.9 36.41,26.04 | 36.7,26.65 | 36.7,26.65 36.99,26.04 | v36.7,25.9 36.99,26.04 | 36.7,26.65 36.41,26.04 | 36.41,26.04 | v36.7,25.9 36.41,26.04 | 36.7,26.65 36.99,26.04 | v36.7,25.9 36.99,26.04 | 36.7,26.65 36.41,26.04 | v36.7,25.9 36.41,26.04 | 36.7,26.65 36.99,26.04 | v36.7,25.9 36.99,26.04
  Top 0.305: JP1.MT2 4.3,18 5.1,18.8 5.1,20.65 JP1.GND
  Top 0.406: 48.8,4.9 39.4,4.9 39.4,5.6 | C13.2 37.3,0.5 | 48.9,0.9 48.9,0.5 | 48.8,4.9 C7.2 | 48.8,4.9 50.4,4.9 50.4,1.43 49.42,1.43 | 43,8.1 45,6.7
  Top 0.508: 32.59,3.37 31.84,3.29 JP3.6 32.6,2.62 32.59,3.37
  Top 0.61: 44.98,26.98 45,27 | 45,27 39.3,27 36.7,27 30.6,27 29.2,27 25.8,27 | 25.8,27 16.9,27 | 16.9,27 16.8,26.9 C1.C 18.2,25.5 18.6,25.1 18.6,24.6 19.1,24.1 U1.2 | C2.C 25.8,27 | 15.28,0.5 1.7,0.5 0.5,1.8 0.5,5 0.98,5 | JP3.6 31.91,1.71 | 31.91,0.5 15.28,0.5 | 45,27 47.4,27 53.1,27 | 31.91,0.5 37.3,0.5 48.9,0.5 53.1,0.5 53.1,1.34 | 16.9,27 2.6,27 2.6,26 JP1.MT1 JP1.MT2 | 53.1,1.34 | 53.1,1.34 JP6.7 | 31.91,0.5 31.91,1.59 | 31.91,1.59 | 31.91,1.59 JP3.6 | 15.28,0.5 15.28,1.58 | 15.28,1.58 | 15.28,1.58 JP4.3 | 0.98,5 | 0.98,5 JP2.1 | 0.98,5 | 0.98,5 1.6,5.5 | 0.98,5 1.6,4.5 | 1.6,4.5 | JP2.1 1.6,4.5 | 0.98,5 1.6,5.5 | JP2.1 1.6,5.5 | 0.98,5 1.6,4.5 | JP2.1 1.6,4.5 | 0.98,5 1.6,5.5 | JP2.1 1.6,5.5 | 31.91,1.59 32.41,2.21 | 31.91,1.59 | 31.91,1.59 31.41,2.21 | 31.91,1.59 32.41,2.21 | 32.41,2.21 | JP3.6 32.41,2.21 | 31.91,1.59 31.41,2.21 | JP3.6 31.41,2.21 | 31.91,1.59 32.41,2.21 | JP3.6 32.41,2.21 | 31.91,1.59 31.41,2.21 | JP3.6 31.41,2.21 | 15.28,1.58 15.78,2.2 | 15.28,1.58 | 15.28,1.58 14.78,2.2 | 15.28,1.58 15.78,2.2 | 15.78,2.2 | JP4.3 15.78,2.2 | 15.28,1.58 14.78,2.2 | JP4.3 14.78,2.2 | 15.28,1.58 15.78,2.2 | JP4.3 15.78,2.2 | 15.28,1.58 14.78,2.2 | JP4.3 14.78,2.2 | 53.1,1.34 53.6,1.96 | 53.1,1.34 | 53.1,1.34 52.6,1.96 | 53.1,1.34 53.6,1.96 | 53.6,1.96 | JP6.7 53.6,1.96 | 53.1,1.34 52.6,1.96 | JP6.7 52.6,1.96 | 53.1,1.34 53.6,1.96 | JP6.7 53.6,1.96 | 53.1,1.34 52.6,1.96 | JP6.7 52.6,1.96
  Top 0.813: JP2.1 2,17.5 JP1.MT2
  Bottom 0.254: v10,24.5 9.7,24.6 9.26,24.6 | v4,24.6 4.75,24.6 | 4.75,24.6 9.26,24.6 | v29.2,21.8 29.2,22.55 | 29.2,22.55 29.2,24.85 | 29.2,24.85 v29.2,25.6 | v29.6,13.6 28.85,13.6 | 28.85,13.6 26.6,13.6 26.27,13.19 | 26.27,13.19 v25.8,12.6 | v36.7,21 36.7,21.75 | 36.7,21.75 36.7,25.15 | 36.7,25.15 v36.7,25.9 | 9.26,24.6 9.82,24.23 v10,24.5 | 9.26,24.6 9.9,24.81 v10,24.5 | 4.75,24.6 4.14,24.89 | v4,24.6 4.14,24.89 | 4.75,24.6 4.14,24.31 | v4,24.6 4.14,24.31 | 4.75,24.6 4.14,24.89 | 4.14,24.89 | v4,24.6 4.14,24.89 | 4.75,24.6 4.14,24.31 | v4,24.6 4.14,24.31 | 4.75,24.6 4.14,24.89 | v4,24.6 4.14,24.89 | 4.75,24.6 4.14,24.31 | v4,24.6 4.14,24.31 | 29.2,22.55 | 29.2,22.55 28.91,21.94 | v29.2,21.8 28.91,21.94 | 29.2,22.55 | 29.2,22.55 29.49,21.94 | v29.2,21.8 29.49,21.94 | 29.2,22.55 28.91,21.94 | 28.91,21.94 | v29.2,21.8 28.91,21.94 | 29.2,22.55 29.49,21.94 | v29.2,21.8 29.49,21.94 | 29.2,22.55 28.91,21.94 | v29.2,21.8 28.91,21.94 | 29.2,22.55 29.49,21.94 | v29.2,21.8 29.49,21.94 | 29.2,24.85 29.49,25.46 | v29.2,25.6 29.49,25.46 | 29.2,24.85 28.91,25.46 | v29.2,25.6 28.91,25.46 | 29.2,24.85 29.49,25.46 | 29.49,25.46 | v29.2,25.6 29.49,25.46 | 29.2,24.85 28.91,25.46 | v29.2,25.6 28.91,25.46 | 29.2,24.85 29.49,25.46 | v29.2,25.6 29.49,25.46 | 29.2,24.85 28.91,25.46 | v29.2,25.6 28.91,25.46 | 26.27,13.19 25.66,12.89 v25.8,12.6 | 26.27,13.19 26.12,12.53 v25.8,12.6 | 28.85,13.6 | 28.85,13.6 29.46,13.31 | v29.6,13.6 29.46,13.31 | 28.85,13.6 | 28.85,13.6 29.46,13.89 | v29.6,13.6 29.46,13.89 | 28.85,13.6 29.46,13.31 | 29.46,13.31 | v29.6,13.6 29.46,13.31 | 28.85,13.6 29.46,13.89 | v29.6,13.6 29.46,13.89 | 28.85,13.6 29.46,13.31 | v29.6,13.6 29.46,13.31 | 28.85,13.6 29.46,13.89 | v29.6,13.6 29.46,13.89 | 36.7,21.75 | 36.7,21.75 36.41,21.14
  Bottom 0.254: v36.7,21 36.41,21.14 | 36.7,21.75 | 36.7,21.75 36.99,21.14 | v36.7,21 36.99,21.14 | 36.7,21.75 36.41,21.14 | 36.41,21.14 | v36.7,21 36.41,21.14 | 36.7,21.75 36.99,21.14 | v36.7,21 36.99,21.14 | 36.7,21.75 36.41,21.14 | v36.7,21 36.41,21.14 | 36.7,21.75 36.99,21.14 | v36.7,21 36.99,21.14 | 36.7,25.15 36.99,25.76 | v36.7,25.9 36.99,25.76 | 36.7,25.15 36.41,25.76 | v36.7,25.9 36.41,25.76 | 36.7,25.15 36.99,25.76 | 36.99,25.76 | v36.7,25.9 36.99,25.76 | 36.7,25.15 36.41,25.76 | v36.7,25.9 36.41,25.76 | 36.7,25.15 36.99,25.76 | v36.7,25.9 36.99,25.76 | 36.7,25.15 36.41,25.76 | v36.7,25.9 36.41,25.76
  other vias: 1.6,14.8 1.6,12.9 1.6,10.8 5.7,18.3 17.4,18.6 19.9,18.6 11.5,9.6 22.8,9.1 16.1,7.6 6.2,3.9 34.6,2.3 43.2,2.2 40.2,9 42.3,23.5 44.3,23.5 46.5,10.2 31.1,9.4 51.7,20.1
  pour Top: 0,27.5 0,0 54.9,0 54.9,27.5
  pour Bottom: 54.9,27.5 54.9,-0.1 0,-0.1 0,27.5
GPIO1  (via drill 0.5)
  Top 0.254: IC2.46 29.05,8 | 29.05,8 29.05,7.75 v29.5,7.4 | 29.05,8 29.18,7.34 v29.5,7.4 | 29.05,8 29.65,7.69 v29.5,7.4
  Bottom 0.254: v29.5,7.4 30.25,7.4 | 30.25,7.4 45.44,7.4 52.38,14.34 JP6.2 | 30.25,7.4 29.64,7.69 | v29.5,7.4 29.64,7.69 | 30.25,7.4 29.64,7.11 | v29.5,7.4 29.64,7.11 | 30.25,7.4 29.64,7.69 | 29.64,7.69 | v29.5,7.4 29.64,7.69 | 30.25,7.4 29.64,7.11 | v29.5,7.4 29.64,7.11 | 30.25,7.4 29.64,7.69 | v29.5,7.4 29.64,7.69 | 30.25,7.4 29.64,7.11 | v29.5,7.4 29.64,7.11
  Bottom 0.508: 52.38,14.34 53.13,14.38 JP6.2 52.41,15.09 52.38,14.34
GPIO2  (via drill 0.5)
  Top 0.254: IC2.45 28.55,7.15 29.2,6.5 29.66,6.5 | 29.66,6.5 30.1,6.5 v30.4,6.6 | 29.66,6.5 30.3,6.29 v30.4,6.6 | 29.66,6.5 30.22,6.87 v30.4,6.6
  Bottom 0.254: v30.4,6.6 31.15,6.6 | 31.15,6.6 47.18,6.6 52.38,11.8 JP6.3 | 31.15,6.6 30.54,6.89 | v30.4,6.6 30.54,6.89 | 31.15,6.6 30.54,6.31 | v30.4,6.6 30.54,6.31 | 31.15,6.6 30.54,6.89 | 30.54,6.89 | v30.4,6.6 30.54,6.89 | 31.15,6.6 30.54,6.31 | v30.4,6.6 30.54,6.31 | 31.15,6.6 30.54,6.89 | v30.4,6.6 30.54,6.89 | 31.15,6.6 30.54,6.31 | v30.4,6.6 30.54,6.31
  Bottom 0.508: 52.38,11.8 53.13,11.84 JP6.3 52.41,12.55 52.38,11.8
GPIO3  (via drill 0.5)
  Top 0.254: IC2.43 27.55,6.95 27.67,6.83 | 27.67,6.83 v28.2,6.3 | 27.67,6.83 27.89,6.19 v28.2,6.3 | 27.67,6.83 28.31,6.61 v28.2,6.3
  Bottom 0.254: v28.2,6.3 28.7,5.8 28.76,5.8 | 28.76,5.8 48.92,5.8 52.38,9.26 JP6.4 | 28.76,5.8 28.5,6.42 v28.2,6.3 | 28.76,5.8 28.11,5.99 v28.2,6.3
  Bottom 0.508: 52.38,9.26 53.13,9.29 JP6.4 52.41,10.01 52.38,9.26
GPIO4  (via drill 0.5)
  Top 0.254: IC2.42 27.05,6.15 28.3,4.9 28.35,4.9 | 28.35,4.9 v29.1,4.9 | 28.35,4.9 | 28.35,4.9 28.96,4.61 | v29.1,4.9 28.96,4.61 | 28.35,4.9 | 28.35,4.9 28.96,5.19 | v29.1,4.9 28.96,5.19 | 28.35,4.9 28.96,4.61 | 28.96,4.61 | v29.1,4.9 28.96,4.61 | 28.35,4.9 28.96,5.19 | v29.1,4.9 28.96,5.19 | 28.35,4.9 28.96,4.61 | v29.1,4.9 28.96,4.61 | 28.35,4.9 28.96,5.19 | v29.1,4.9 28.96,5.19
  Bottom 0.254: v29.1,4.9 29.85,4.9 | 29.85,4.9 50.56,4.9 52.38,6.72 JP6.5 | 29.85,4.9 29.24,5.19 | v29.1,4.9 29.24,5.19 | 29.85,4.9 29.24,4.61 | v29.1,4.9 29.24,4.61 | 29.85,4.9 29.24,5.19 | 29.24,5.19 | v29.1,4.9 29.24,5.19 | 29.85,4.9 29.24,4.61 | v29.1,4.9 29.24,4.61 | 29.85,4.9 29.24,5.19 | v29.1,4.9 29.24,5.19 | 29.85,4.9 29.24,4.61 | v29.1,4.9 29.24,4.61
  Bottom 0.508: 52.38,6.72 53.13,6.75 JP6.5 52.41,7.47 52.38,6.72
GPIO5  (via drill 0.5)
  Top 0.254: IC2.41 26.55,5.5 | 26.55,5.5 26.55,5.35 v27,4.9 | 26.55,5.5 26.68,4.84 v27,4.9 | 26.55,5.5 27.15,5.19 v27,4.9
  Bottom 0.254: v27,4.9 27.56,4.4 | 27.56,4.4 | 27.56,4.4 27.9,4.1 52.3,4.1 52.38,4.18 JP6.6 | 27.56,4.4 27.3,5.03 | 27.3,5.03 | 27.56,4.4 | 27.56,4.4 26.91,4.59 | v27,4.9 26.91,4.59 | 27.56,4.4 27.3,5.03 | 27.56,4.4 26.91,4.59 | 27.56,4.4 27.3,5.03 | v27,4.9 27.3,5.03 | 27.56,4.4 26.91,4.59 | v27,4.9 26.91,4.59
  Bottom 0.508: 52.38,4.18 53.13,4.21 JP6.6 52.41,4.93 52.38,4.18
LED1_B
  Top 0.254: IC2.28 18.05,14.85 14.8,11.6 14.5,11.6 LED1.4
LED1_G
  Top 0.254: LED1.6 15.7,14.7 16.85,15.85 IC2.26
LED1_R
  Top 0.254: 15,13.2 14.4,13.2 LED1.5 15.1,13 17.45,15.35 IC2.27
LED2_B  (via drill 0.5)
  Top 0.254: LED2.4 47.71,12.26 | 47.71,12.26 v47,12.5 | v28.5,16.1 29.03,16.63 | 29.03,16.63 29.05,16.65 IC2.15 | 47.71,12.26 47.23,12.73 v47,12.5 | 47.71,12.26 47.04,12.18 v47,12.5 | 29.03,16.63 28.39,16.41 v28.5,16.1 | 29.03,16.63 28.81,15.99 v28.5,16.1
  Bottom 0.254: v28.5,16.1 29.03,15.57 | 29.03,15.57 32.1,12.5 46.25,12.5 | 46.25,12.5 v47,12.5 | 46.25,12.5 | 46.25,12.5 46.86,12.21 | v47,12.5 46.86,12.21 | 46.25,12.5 | 46.25,12.5 46.86,12.79 | v47,12.5 46.86,12.79 | 46.25,12.5 46.86,12.21 | 46.86,12.21 | v47,12.5 46.86,12.21 | 46.25,12.5 46.86,12.79 | v47,12.5 46.86,12.79 | 46.25,12.5 46.86,12.21 | v47,12.5 46.86,12.21 | 46.25,12.5 46.86,12.79 | v47,12.5 46.86,12.79 | 29.03,15.57 28.81,16.21 v28.5,16.1 | 29.03,15.57 28.39,15.79 v28.5,16.1
LED2_G  (via drill 0.5)
  Top 0.254: LED2.6 47.75,15.1 | 47.75,15.1 v47,15.1 | v31.5,18.1 30.75,18.1 | 30.75,18.1 IC2.13 | 47.75,15.1 47.14,15.39 | v47,15.1 47.14,15.39 | 47.75,15.1 47.14,14.81 | v47,15.1 47.14,14.81 | 47.75,15.1 47.14,15.39 | 47.14,15.39 | v47,15.1 47.14,15.39 | 47.75,15.1 47.14,14.81 | v47,15.1 47.14,14.81 | 47.75,15.1 47.14,15.39 | v47,15.1 47.14,15.39 | 47.75,15.1 47.14,14.81 | v47,15.1 47.14,14.81 | 30.75,18.1 | 30.75,18.1 31.36,17.81 | v31.5,18.1 31.36,17.81 | 30.75,18.1 | 30.75,18.1 31.36,18.39 | v31.5,18.1 31.36,18.39 | 30.75,18.1 31.36,17.81 | 31.36,17.81 | v31.5,18.1 31.36,17.81 | 30.75,18.1 31.36,18.39 | v31.5,18.1 31.36,18.39 | 30.75,18.1 31.36,17.81 | v31.5,18.1 31.36,17.81 | 30.75,18.1 31.36,18.39 | v31.5,18.1 31.36,18.39
  Bottom 0.254: v47,15.1 46.25,15.1 | 46.25,15.1 34.5,15.1 32.03,17.57 | 32.03,17.57 v31.5,18.1 | 46.25,15.1 | 46.25,15.1 46.86,14.81 | v47,15.1 46.86,14.81 | 46.25,15.1 | 46.25,15.1 46.86,15.39 | v47,15.1 46.86,15.39 | 46.25,15.1 46.86,14.81 | 46.86,14.81 | v47,15.1 46.86,14.81 | 46.25,15.1 46.86,15.39 | v47,15.1 46.86,15.39 | 46.25,15.1 46.86,14.81 | v47,15.1 46.86,14.81 | 46.25,15.1 46.86,15.39 | v47,15.1 46.86,15.39 | 32.03,17.57 31.81,18.21 v31.5,18.1 | 32.03,17.57 31.39,17.79 v31.5,18.1
LED2_R  (via drill 0.5)
  Top 0.254: LED2.5 47.74,13.68 | 47.74,13.68 v47,13.8 | v29.9,16.1 29.55,16.45 29.55,16.76 | 29.55,16.76 IC2.14 | 47.74,13.68 47.19,14.07 v47,13.8 | 47.74,13.68 47.09,13.49 v47,13.8 | 29.55,16.76 29.57,16.09 v29.9,16.1 | 29.55,16.76 30.09,16.36 v29.9,16.1
  Bottom 0.254: v29.9,16.1 30.43,15.57 | 30.43,15.57 32.2,13.8 46.25,13.8 | 46.25,13.8 v47,13.8 | 46.25,13.8 | 46.25,13.8 46.86,13.51 | v47,13.8 46.86,13.51 | 46.25,13.8 | 46.25,13.8 46.86,14.09 | v47,13.8 46.86,14.09 | 46.25,13.8 46.86,13.51 | 46.86,13.51 | v47,13.8 46.86,13.51 | 46.25,13.8 46.86,14.09 | v47,13.8 46.86,14.09 | 46.25,13.8 46.86,13.51 | v47,13.8 46.86,13.51 | 46.25,13.8 46.86,14.09 | v47,13.8 46.86,14.09 | 30.43,15.57 30.21,16.21 v29.9,16.1 | 30.43,15.57 29.79,15.79 v29.9,16.1
N$1
  Top 0.61: JP2.2 2.71,1.75 2.73,1.75 | 2.73,1.75 D1.A | 2.73,1.75 2.63,2.54 JP2.2 | 2.73,1.75 1.94,1.83 JP2.2
N$2
  Top 0.254: R4.1 27.7,20.1 26.6,19 26.6,18.15 IC2.20
N$3
  Top 0.254: R1.1 Z1.1 8.95,21.7 8.2,21.7 7.25,22.65 JP1.D-
N$4
  Top 0.254: R7.1 R2.1 Z2.1 8.95,19.9 8.1,19.9 7.7,20.3 7.7,21.3 7,22 JP1.D+
N$6
  Top 0.254: IC2.5 34.15,12.85 34.8,12.2 34.8,7.4 36.15,6.05 R6.2 37.67,6.05
  Top 0.305: 37.67,6.05 38.15,6.05 38.4,6.3 38.4,7.6 38.6,7.8 39.38,7.8 C6.1 40.62,7.78 Y1.1
N$7
  Top 0.254: R6.1 36.45,7.75 35.4,8.8 35.4,12.6 34.6,13.4 34.55,13.35 IC2.6
  Top 0.305: R6.1 39.45,9.9 45.3,9.9 45.85,9.35 Y1.3 48.02,8.55 C7.1
N$8
  Top 0.254: R10.2 9,10.9 LED1.3
  Top 0.406: 8.7,11 LED1.3
N$9
  Top 0.406: JP1.VBUS 6.7,23.3 F1.2
N$10
  Top 0.254: R11.2 9.1,15.1 9.4,14.8 LED1.1
  Top 0.406: 8.7,15 LED1.1
N$11
  Top 0.254: R12.2 LED1.2
N$12
  Top 0.254: R13.2 44.4,11.5 LED2.3
N$13
  Top 0.254: 44.2,15.5 LED2.1 42.25,15.1 R14.2
N$14
  Top 0.254: 44.5,13.5 LED2.2 41.85,13.4 R15.2
N$18
  Top 0.254: Y2.P$2 39.62,3.17 C13.1 36.9,3.17 33.6,6.47 33.6,11.6 33.35,11.85 IC2.3
N$19
  Top 0.254: IC2.4 33.65,12.35 34.2,11.8 34.2,7 37,4.2 41,4.2 41.6,3.6 | 41.6,3.6 41.6,2.8 40.8,2 Y2.P$1 | C14.1 48.48,3.6 41.6,3.6
N$31
  Top 0.254: 39.4,25.7 47.2,25.7
N$32
  Top 0.254: 47.3,25.8 47.3,26.9
N$33
  Top 0.254: 39.3,21.2 47.3,21.2
N$35
  Top 0.406: 45.8,6.2 45.8,5
RESET
  Top 0.254: IC2.7 34.05,13.85 34.9,14.7 34.9,15.45 R3.2 34.9,15.5 34.9,16.3 35.1,16.5 36.5,16.5 36.7,16.7 36.7,17.48 C5.1 36.67,17.27
SWCLK
  Top 0.254: JP3.3 24.55,2.87 24.55,3.59 IC2.37 22.55,7.1 R9.2
  Top 0.508: 24.55,3.59 | 24.55,3.59 | 24.55,3.59 24.9,2.93 | 24.9,2.93 | 24.55,3.59 23.92,3.19 | 23.92,3.19 | JP3.3 23.92,3.19 | 24.55,3.59 24.9,2.93 | JP3.3 24.9,2.93 | 24.55,3.59 23.92,3.19 | JP3.3 23.92,3.19 | 24.55,3.59 24.9,2.93 | JP3.3 24.9,2.93
SWDIO  (via drill 0.5)
  Top 0.254: 21.35,2.41 21.35,3.54 R8.2 22.3,5 22.47,5.17 | 22.47,5.17 v23,5.7 | v19.6,10.8 20.13,11.33 | 20.13,11.33 20.95,11.85 IC2.34 | 22.47,5.17 23.11,5.39 v23,5.7 | 22.47,5.17 22.69,5.81 v23,5.7 | 20.13,11.33 19.49,11.11 v19.6,10.8 | 20.13,11.33 19.91,10.69 v19.6,10.8
  Top 0.508: 21.35,3.54 21.1,2.84 JP3.2 22.03,3.23 21.35,3.54
  Bottom 0.254: v23,5.7 23,6.45 | 23,6.45 23,6.8 22.3,7.5 20.6,7.5 19.6,8.5 19.6,10.05 | v19.6,10.8 19.6,10.05 | 23,6.45 | 23,6.45 22.71,5.84 | v23,5.7 22.71,5.84 | 23,6.45 | 23,6.45 23.29,5.84 | v23,5.7 23.29,5.84 | 23,6.45 22.71,5.84 | 22.71,5.84 | v23,5.7 22.71,5.84 | 23,6.45 23.29,5.84 | v23,5.7 23.29,5.84 | 23,6.45 22.71,5.84 | v23,5.7 22.71,5.84 | 23,6.45 23.29,5.84 | v23,5.7 23.29,5.84 | 19.6,10.05 19.89,10.66 | v19.6,10.8 19.89,10.66 | 19.6,10.05 19.31,10.66 | v19.6,10.8 19.31,10.66 | 19.6,10.05 19.89,10.66 | 19.89,10.66 | v19.6,10.8 19.89,10.66 | 19.6,10.05 19.31,10.66 | v19.6,10.8 19.31,10.66 | 19.6,10.05 19.89,10.66 | v19.6,10.8 19.89,10.66 | 19.6,10.05 19.31,10.66 | v19.6,10.8 19.31,10.66
SWO
  Top 0.254: IC2.39 25.55,3.89 26.11,3.33 JP3.4
  Top 0.508: 26.11,3.33 26.14,2.58 JP3.4 26.86,3.29 26.11,3.33
SWRST
  Top 0.254: IC2.40 26.05,4.45 26.5,4 27.98,4 28.65,3.33 JP3.5
  Top 0.508: 28.65,3.33 28.68,2.58 JP3.5 29.4,3.29 28.65,3.33
USART1_RX  (via drill 0.5)
  Top 0.254: IC2.31 19.75,13.35 14.23,7.83 | 14.23,7.83 v13.7,7.3 | 14.23,7.83 13.59,7.61 v13.7,7.3 | 14.23,7.83 14.01,7.19 v13.7,7.3
  Bottom 0.254: v13.7,7.3 13.17,6.77 | 13.17,6.77 12.74,6.34 12.74,3.62 | 12.74,3.62 | 12.74,3.62 JP4.2 | 13.17,6.77 13.81,6.99 v13.7,7.3 | 13.17,6.77 13.39,7.41 v13.7,7.3
  Bottom 0.508: 12.74,3.62 | 12.74,3.62 12.23,3.06 | 12.74,3.62 13.25,3.06 | 12.74,3.62 12.23,3.06 | JP4.2 12.23,3.06 | 12.74,3.62 13.25,3.06 | JP4.2 13.25,3.06 | 12.74,3.62 12.23,3.06 | JP4.2 12.23,3.06 | 12.74,3.62 13.25,3.06 | JP4.2 13.25,3.06
USART1_TX  (via drill 0.5)
  Top 0.254: IC2.30 18.65,13.85 12.63,7.83 | 12.63,7.83 v12.1,7.3 | 12.63,7.83 11.99,7.61 v12.1,7.3 | 12.63,7.83 12.41,7.19 v12.1,7.3
  Bottom 0.254: v12.1,7.3 11.57,6.77 | 11.57,6.77 10.2,5.4 10.2,3.62 | 10.2,3.62 | 10.2,3.62 JP4.1 | 11.57,6.77 12.21,6.99 v12.1,7.3 | 11.57,6.77 11.79,7.41 v12.1,7.3
  Bottom 0.508: 10.2,3.62 | 10.2,3.62 9.69,3.06 | 10.2,3.62 10.71,3.06 | 10.2,3.62 9.69,3.06 | JP4.1 9.69,3.06 | 10.2,3.62 10.71,3.06 | JP4.1 10.71,3.06 | 10.2,3.62 9.69,3.06 | JP4.1 9.69,3.06 | 10.2,3.62 10.71,3.06 | JP4.1 10.71,3.06
USB_DM  (via drill 0.5 pad 0.25)
  Top 0.254: IC2.32 24.65,12.85 25.2,13.4 25.2,14.25 | 25.2,14.25 v25.2,15 | R1.2 12.85,23.35 14.87,21.33 | 14.87,21.33 v15.4,20.8 | 14.87,21.33 15.09,20.69 v15.4,20.8 | 14.87,21.33 15.51,21.11 v15.4,20.8 | 25.2,14.25 25.49,14.86 | v25.2,15 25.49,14.86 | 25.2,14.25 24.91,14.86 | v25.2,15 24.91,14.86 | 25.2,14.25 25.49,14.86 | 25.49,14.86 | v25.2,15 25.49,14.86 | 25.2,14.25 24.91,14.86 | v25.2,15 24.91,14.86 | 25.2,14.25 25.49,14.86 | v25.2,15 25.49,14.86 | 25.2,14.25 24.91,14.86 | v25.2,15 24.91,14.86
  Bottom 0.254: v15.4,20.8 16.15,20.8 | 16.15,20.8 21.4,20.8 23.6,18.6 23.6,16.4 24.64,15.49 | 24.64,15.49 v25.2,15 | 24.64,15.49 24.9,14.87 | v25.2,15 24.9,14.87 | 16.15,20.8 15.54,21.09 | v15.4,20.8 15.54,21.09 | 16.15,20.8 15.54,20.51 | v15.4,20.8 15.54,20.51 | 16.15,20.8 15.54,21.09 | 15.54,21.09 | v15.4,20.8 15.54,21.09 | 16.15,20.8 15.54,20.51 | v15.4,20.8 15.54,20.51 | 16.15,20.8 15.54,21.09 | v15.4,20.8 15.54,21.09 | 16.15,20.8 15.54,20.51 | v15.4,20.8 15.54,20.51 | 24.64,15.49 24.9,14.87 | v25.2,15 24.9,14.87 | 24.64,15.49 25.29,15.31 v25.2,15
USB_DP  (via drill 0.5)
  Top 0.254: R2.2 11,18.2 12.27,16.93 | 12.27,16.93 v12.8,16.4 | v20.1,12.5 20.55,12.35 20.84,12.35 | 20.84,12.35 IC2.33 | 12.27,16.93 12.49,16.29 v12.8,16.4 | 12.27,16.93 12.91,16.71 v12.8,16.4 | 20.84,12.35 20.3,12.76 | v20.1,12.5 20.3,12.76 | 20.84,12.35 20.18,12.18 | v20.1,12.5 20.18,12.18 | 20.84,12.35 20.3,12.76 | v20.1,12.5 20.3,12.76 | 20.84,12.35 20.18,12.18 | v20.1,12.5 20.18,12.18
  Bottom 0.254: v12.8,16.4 13.33,15.87 | 13.33,15.87 16.7,12.5 19.35,12.5 | 19.35,12.5 v20.1,12.5 | 13.33,15.87 13.11,16.51 v12.8,16.4 | 13.33,15.87 12.69,16.09 v12.8,16.4 | 19.35,12.5 | 19.35,12.5 19.96,12.21 | v20.1,12.5 19.96,12.21 | 19.35,12.5 | 19.35,12.5 19.96,12.79 | v20.1,12.5 19.96,12.79 | 19.35,12.5 19.96,12.21 | 19.96,12.21 | v20.1,12.5 19.96,12.21 | 19.35,12.5 19.96,12.79 | v20.1,12.5 19.96,12.79 | 19.35,12.5 19.96,12.21 | v20.1,12.5 19.96,12.21 | 19.35,12.5 19.96,12.79 | v20.1,12.5 19.96,12.79
USB_PULLUP
  Top 0.254: R7.2 15.1,16.35 IC2.25
USB_VCC
  Top 0.254: U1.3 20.65,23.15 21,23.5 21,24.5 20.5,25 20.05,25 U1.1
  Top 0.61: F1.1 13.2,25.6 16.3,22.5 | C1.A 19.35,22.7 U1.3
  Top 0.813: 16.3,22.5 16.6,22.5 C1.A
WAKEUP
  Top 0.254: IC2.10 32.45,15.35 32.7,15.6 R16.2 36.23,24.25 S1.B2

### Text on the board
tNames: UPDATE | ON/OFF | VDD | 1 | 2 | 3 | 4 | G | 5 | TX | RX | GND | Y2 | V | GND | 2014-2-10 V0.1 | VDD | IO | CLK | TO | RST | GND